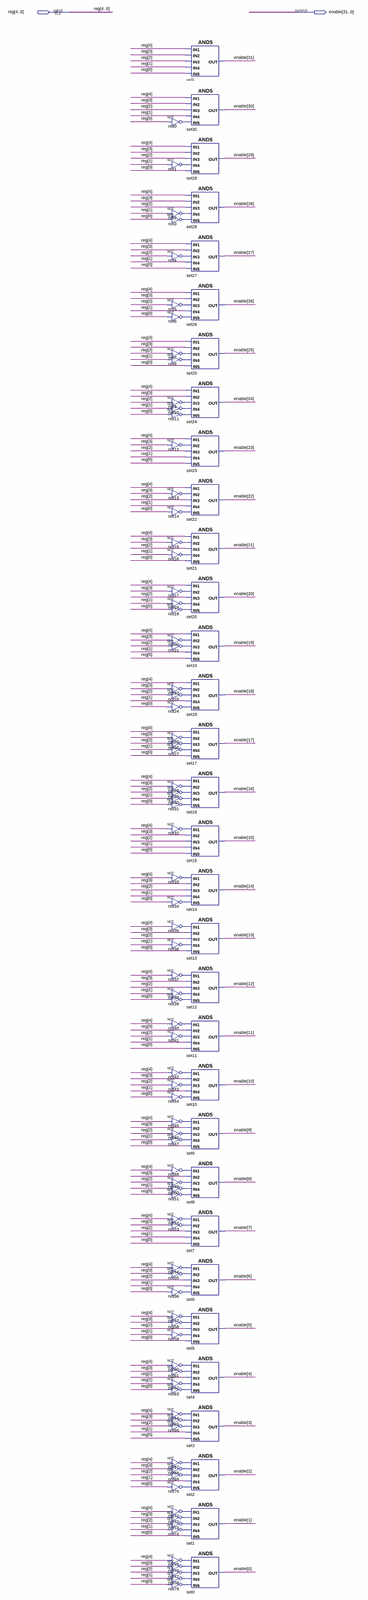
[diagram p0: schematic sheet, whole]
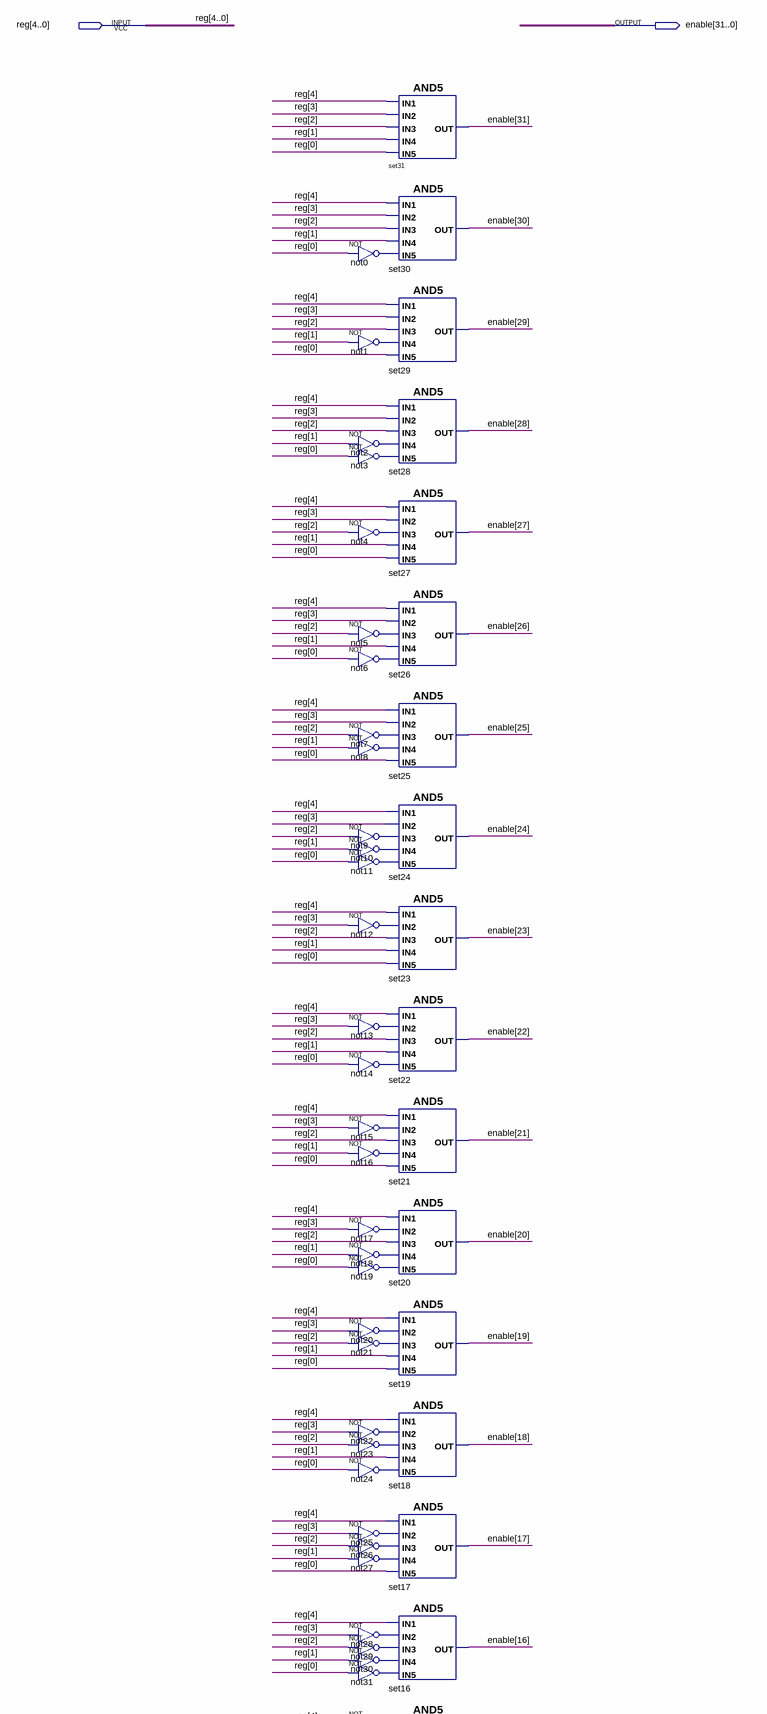
[diagram p1: schematic sheet, upper part]
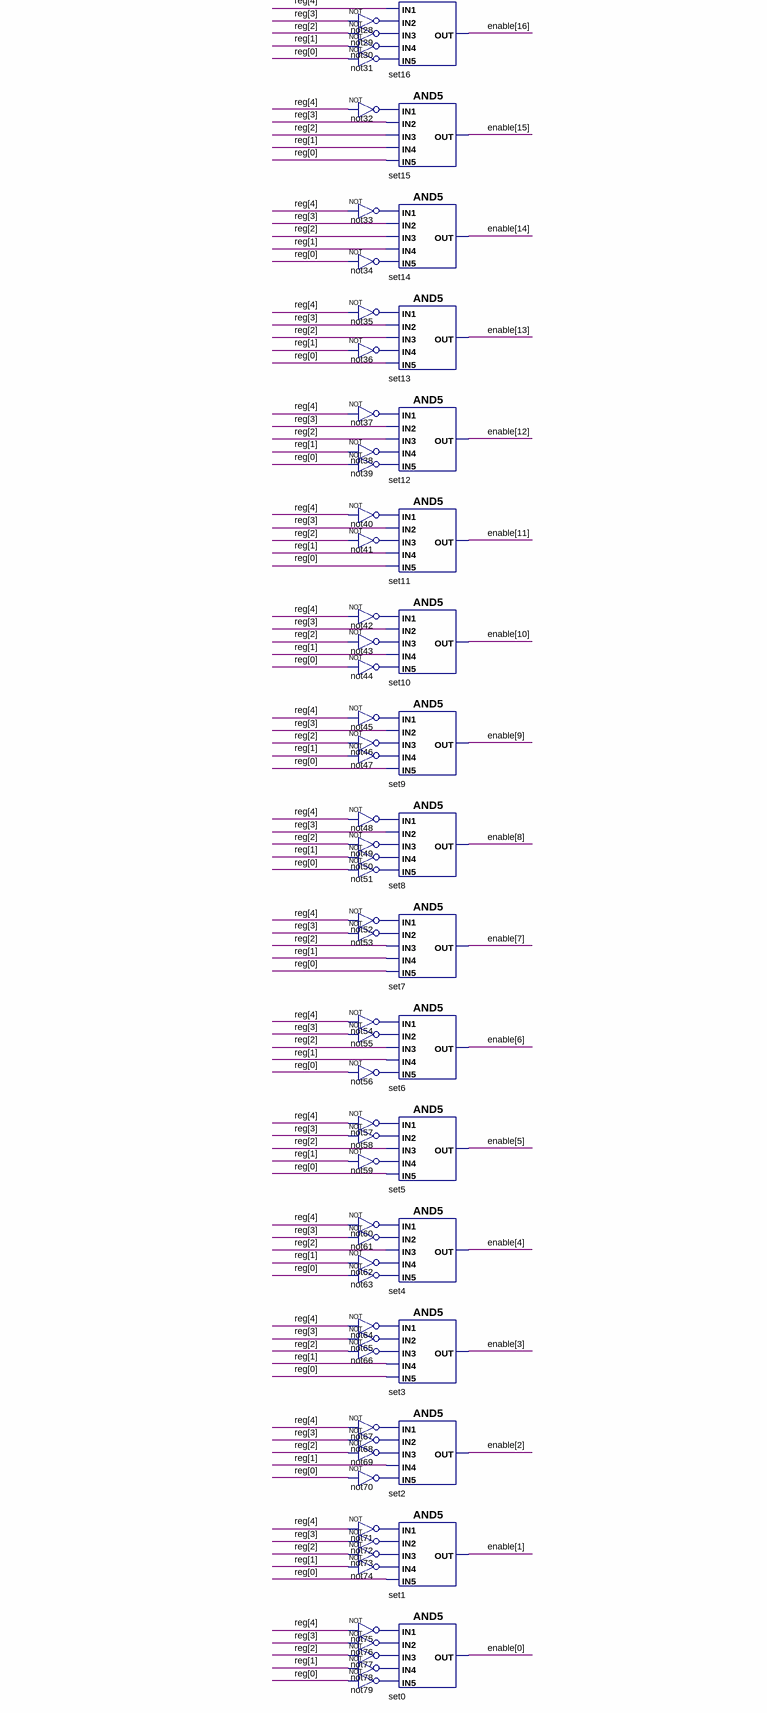
[diagram p2: schematic sheet, lower part]
// Quartus schematic write_register.bdf as structural Verilog: 112 symbols, 2 pins
module write_register (
  input  [4:0] \reg ,
  output [31:0] enable
);

  wire not0_out, not1_out, not2_out, not3_out, not4_out, not5_out, not6_out, not7_out, not8_out, not9_out,
       not10_out, not11_out, not12_out, not13_out, not14_out, not15_out, not16_out, not17_out, not18_out,
       not19_out, not20_out, not21_out, not22_out, not23_out, not24_out, not25_out, not26_out, not27_out,
       not28_out, not29_out, not30_out, not31_out, not32_out, not33_out, not34_out, not35_out, not36_out,
       not37_out, not38_out, not39_out, not40_out, not41_out, not42_out, not43_out, not44_out, not45_out,
       not46_out, not47_out, not48_out, not49_out, not50_out, not51_out, not52_out, not53_out, not54_out,
       not55_out, not56_out, not57_out, not58_out, not59_out, not60_out, not61_out, not62_out, not63_out,
       not64_out, not65_out, not66_out, not67_out, not68_out, not69_out, not70_out, not71_out, not72_out,
       not73_out, not74_out, not75_out, not76_out, not77_out, not78_out, not79_out;

  and set31 (enable[31], \reg [4], \reg [3], \reg [2], \reg [1], \reg [0]);
  and set30 (enable[30], \reg [4], \reg [3], \reg [2], \reg [1], not0_out);
  not not0 (not0_out, \reg [0]);
  and set29 (enable[29], \reg [4], \reg [3], \reg [2], not1_out, \reg [0]);
  not not1 (not1_out, \reg [1]);
  and set28 (enable[28], \reg [4], \reg [3], \reg [2], not2_out, not3_out);
  not not2 (not2_out, \reg [1]);
  not not3 (not3_out, \reg [0]);
  and set27 (enable[27], \reg [4], \reg [3], not4_out, \reg [1], \reg [0]);
  not not4 (not4_out, \reg [2]);
  and set26 (enable[26], \reg [4], \reg [3], not5_out, \reg [1], not6_out);
  not not5 (not5_out, \reg [2]);
  not not6 (not6_out, \reg [0]);
  and set25 (enable[25], \reg [4], \reg [3], not7_out, not8_out, \reg [0]);
  not not7 (not7_out, \reg [2]);
  not not8 (not8_out, \reg [1]);
  and set24 (enable[24], \reg [4], \reg [3], not9_out, not10_out, not11_out);
  not not9 (not9_out, \reg [2]);
  not not10 (not10_out, \reg [1]);
  not not11 (not11_out, \reg [0]);
  and set23 (enable[23], \reg [4], not12_out, \reg [2], \reg [1], \reg [0]);
  not not12 (not12_out, \reg [3]);
  and set22 (enable[22], \reg [4], not13_out, \reg [2], \reg [1], not14_out);
  not not13 (not13_out, \reg [3]);
  not not14 (not14_out, \reg [0]);
  and set21 (enable[21], \reg [4], not15_out, \reg [2], not16_out, \reg [0]);
  not not15 (not15_out, \reg [3]);
  not not16 (not16_out, \reg [1]);
  and set20 (enable[20], \reg [4], not17_out, \reg [2], not18_out, not19_out);
  not not17 (not17_out, \reg [3]);
  not not18 (not18_out, \reg [1]);
  not not19 (not19_out, \reg [0]);
  and set19 (enable[19], \reg [4], not20_out, not21_out, \reg [1], \reg [0]);
  not not20 (not20_out, \reg [3]);
  not not21 (not21_out, \reg [2]);
  and set18 (enable[18], \reg [4], not22_out, not23_out, \reg [1], not24_out);
  not not22 (not22_out, \reg [3]);
  not not23 (not23_out, \reg [2]);
  not not24 (not24_out, \reg [0]);
  and set17 (enable[17], \reg [4], not25_out, not26_out, not27_out, \reg [0]);
  not not25 (not25_out, \reg [3]);
  not not26 (not26_out, \reg [2]);
  not not27 (not27_out, \reg [1]);
  and set16 (enable[16], \reg [4], not28_out, not29_out, not30_out, not31_out);
  not not28 (not28_out, \reg [3]);
  not not29 (not29_out, \reg [2]);
  not not30 (not30_out, \reg [1]);
  not not31 (not31_out, \reg [0]);
  and set15 (enable[15], not32_out, \reg [3], \reg [2], \reg [1], \reg [0]);
  not not32 (not32_out, \reg [4]);
  and set14 (enable[14], not33_out, \reg [3], \reg [2], \reg [1], not34_out);
  not not33 (not33_out, \reg [4]);
  not not34 (not34_out, \reg [0]);
  and set13 (enable[13], not35_out, \reg [3], \reg [2], not36_out, \reg [0]);
  not not35 (not35_out, \reg [4]);
  not not36 (not36_out, \reg [1]);
  and set12 (enable[12], not37_out, \reg [3], \reg [2], not38_out, not39_out);
  not not37 (not37_out, \reg [4]);
  not not38 (not38_out, \reg [1]);
  not not39 (not39_out, \reg [0]);
  and set11 (enable[11], not40_out, \reg [3], not41_out, \reg [1], \reg [0]);
  not not40 (not40_out, \reg [4]);
  not not41 (not41_out, \reg [2]);
  and set10 (enable[10], not42_out, \reg [3], not43_out, \reg [1], not44_out);
  not not42 (not42_out, \reg [4]);
  not not43 (not43_out, \reg [2]);
  not not44 (not44_out, \reg [0]);
  and set9 (enable[9], not45_out, \reg [3], not46_out, not47_out, \reg [0]);
  not not45 (not45_out, \reg [4]);
  not not46 (not46_out, \reg [2]);
  not not47 (not47_out, \reg [1]);
  and set8 (enable[8], not48_out, \reg [3], not49_out, not50_out, not51_out);
  not not48 (not48_out, \reg [4]);
  not not49 (not49_out, \reg [2]);
  not not50 (not50_out, \reg [1]);
  not not51 (not51_out, \reg [0]);
  and set7 (enable[7], not52_out, not53_out, \reg [2], \reg [1], \reg [0]);
  not not52 (not52_out, \reg [4]);
  not not53 (not53_out, \reg [3]);
  and set6 (enable[6], not54_out, not55_out, \reg [2], \reg [1], not56_out);
  not not54 (not54_out, \reg [4]);
  not not55 (not55_out, \reg [3]);
  not not56 (not56_out, \reg [0]);
  and set5 (enable[5], not57_out, not58_out, \reg [2], not59_out, \reg [0]);
  not not57 (not57_out, \reg [4]);
  not not58 (not58_out, \reg [3]);
  not not59 (not59_out, \reg [1]);
  and set4 (enable[4], not60_out, not61_out, \reg [2], not62_out, not63_out);
  not not60 (not60_out, \reg [4]);
  not not61 (not61_out, \reg [3]);
  not not62 (not62_out, \reg [1]);
  not not63 (not63_out, \reg [0]);
  and set3 (enable[3], not64_out, not65_out, not66_out, \reg [1], \reg [0]);
  not not64 (not64_out, \reg [4]);
  not not65 (not65_out, \reg [3]);
  not not66 (not66_out, \reg [2]);
  and set2 (enable[2], not67_out, not68_out, not69_out, \reg [1], not70_out);
  not not67 (not67_out, \reg [4]);
  not not68 (not68_out, \reg [3]);
  not not69 (not69_out, \reg [2]);
  not not70 (not70_out, \reg [0]);
  and set1 (enable[1], not71_out, not72_out, not73_out, not74_out, \reg [0]);
  not not71 (not71_out, \reg [4]);
  not not72 (not72_out, \reg [3]);
  not not73 (not73_out, \reg [2]);
  not not74 (not74_out, \reg [1]);
  and set0 (enable[0], not75_out, not76_out, not77_out, not78_out, not79_out);
  not not75 (not75_out, \reg [4]);
  not not76 (not76_out, \reg [3]);
  not not77 (not77_out, \reg [2]);
  not not78 (not78_out, \reg [1]);
  not not79 (not79_out, \reg [0]);
endmodule
